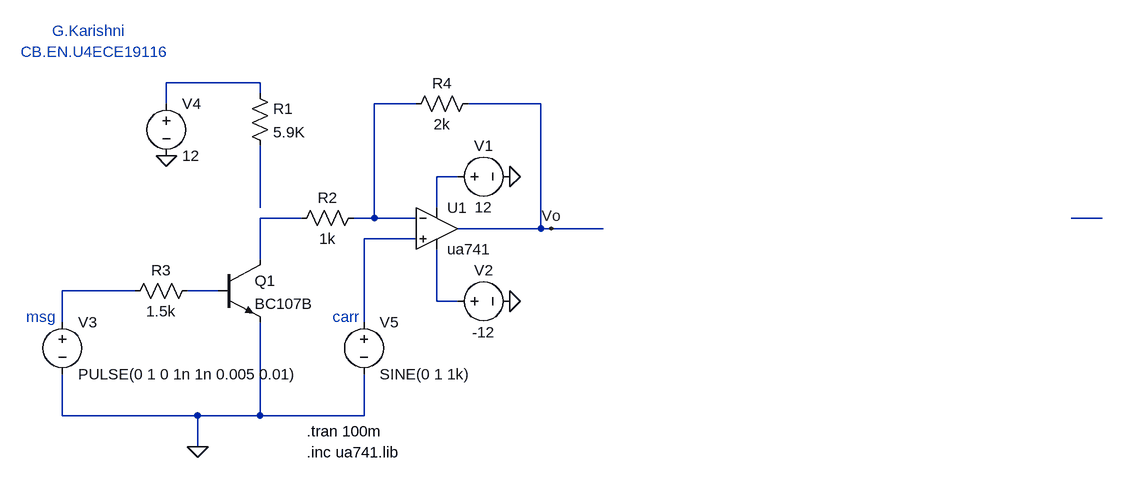
[diagram p0: schematic Draft_modulation.asc]
Draft_modulation.asc, the LTspice schematic file:
Version 4
SHEET 1 1648 680
WIRE 192 -32 48 -32
WIRE 192 -16 192 -32
WIRE 48 0 48 -32
WIRE 432 0 368 0
WIRE 624 0 512 0
WIRE 496 112 464 112
WIRE 192 160 192 64
WIRE 464 160 464 112
WIRE 256 176 192 176
WIRE 368 176 368 0
WIRE 368 176 336 176
WIRE 432 176 368 176
WIRE 1488 176 1440 176
WIRE 624 192 624 0
WIRE 624 192 496 192
WIRE 640 192 624 192
WIRE 720 192 640 192
WIRE 432 208 352 208
WIRE 192 240 192 176
WIRE 0 288 -112 288
WIRE 128 288 80 288
WIRE 464 304 464 224
WIRE 496 304 464 304
WIRE -112 336 -112 288
WIRE 352 336 352 208
WIRE -112 480 -112 416
WIRE 96 480 -112 480
WIRE 192 480 192 336
WIRE 192 480 96 480
WIRE 352 480 352 416
WIRE 352 480 192 480
WIRE 96 528 96 480
FLAG 48 80 0
FLAG 576 304 0
FLAG 576 112 0
FLAG 96 528 0
FLAG 640 192 Vo
SYMBOL res 176 -32 R0
SYMATTR InstName R1
SYMATTR Value 5.9K
SYMATTR SpiceLine tol=1 pwr=0.1
SYMBOL res 352 160 R90
WINDOW 0 0 56 VBottom 2
WINDOW 3 32 56 VTop 2
SYMATTR InstName R2
SYMATTR Value 1k
SYMBOL res 96 272 R90
WINDOW 0 0 56 VBottom 2
WINDOW 3 32 56 VTop 2
SYMATTR InstName R3
SYMATTR Value 1.5k
SYMBOL npn 128 240 R0
SYMATTR InstName Q1
SYMATTR Value BC107B
SYMBOL OpAmps\\ua741 464 128 R0
SYMATTR InstName U1
SYMBOL res 528 -16 R90
WINDOW 0 0 56 VBottom 2
WINDOW 3 32 56 VTop 2
SYMATTR InstName R4
SYMATTR Value 2k
SYMBOL voltage 480 112 R270
WINDOW 0 32 56 VTop 2
WINDOW 3 -32 56 VBottom 2
WINDOW 123 0 0 Left 0
WINDOW 39 0 0 Left 0
SYMATTR InstName V1
SYMATTR Value 12
SYMBOL voltage 480 304 R270
WINDOW 0 32 56 VTop 2
WINDOW 3 -32 56 VBottom 2
WINDOW 123 0 0 Left 0
WINDOW 39 0 0 Left 0
SYMATTR InstName V2
SYMATTR Value -12
SYMBOL voltage -112 320 R0
WINDOW 123 0 0 Left 0
WINDOW 39 0 0 Left 0
SYMATTR InstName V3
SYMATTR Value PULSE(0 1 0 1n 1n 0.005 0.01)
SYMBOL voltage 352 320 R0
WINDOW 123 0 0 Left 0
WINDOW 39 0 0 Left 0
SYMATTR InstName V5
SYMATTR Value SINE(0 1 1k)
SYMBOL voltage 48 -16 R0
WINDOW 123 0 0 Left 0
WINDOW 39 0 0 Left 0
SYMATTR InstName V4
SYMATTR Value 12
TEXT -168 328 Left 2 ;msg
TEXT 304 328 Left 2 ;carr
TEXT 264 504 Left 2 !.tran 100m
TEXT 264 536 Left 2 !.inc ua741.lib
TEXT -128 -112 Left 2 ;G.Karishni
TEXT -176 -80 Left 2 ;CB.EN.U4ECE19116

The netlist it stands for:
* Draft_modulation.asc
R1 N001 N004 5.9K tol=1 pwr=0.1
R2 N002 N005 1k
R3 N009 N008 1.5k
Q1 N005 N009 0 0 BC107B
XU1 N007 N002 N003 N010 Vo ua741  ; pins In+ In- V+ V- OUT
R4 Vo N002 2k
V1 N003 0 12
V2 N010 0 -12
V3 N008 0 PULSE(0 1 0 1n 1n 0.005 0.01)
V5 N007 0 SINE(0 1 1k)
V4 N001 0 12
.model NPN NPN
.model PNP PNP
.lib standard.bjt
* msg
* carr
.tran 100m
.inc ua741.lib
* G.Karishni
* CB.EN.U4ECE19116
.backanno
.end